# EAGLE design Power Supply (EAGLE 8.4.0)
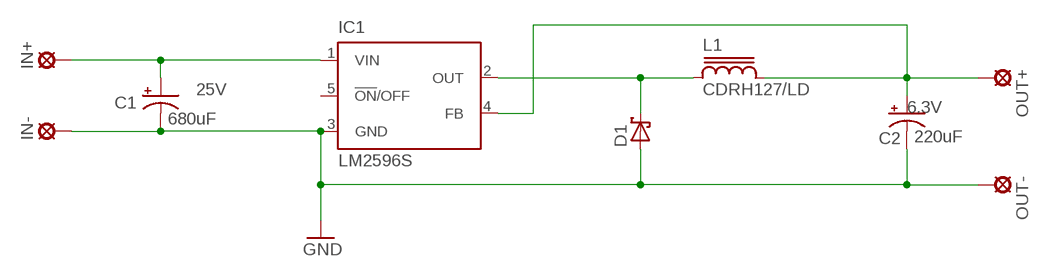
[diagram p0: schematic, sheet 1]

## Parts
C1  680uF  CPOL-USE5-10.5  [E5-10,5]
C2  220uF  CPOL-USUD-6,3X5,8  [UD-6,3X5,8_NICHICON]
D1  SCHOTTKY-DIODESMD  [SMB]
IC1  LM2596S  [TO263-5]
IN+  LSP13  [LSP13]
IN-  LSP13  [LSP13]
L1  CDRH127/LD  [CDRH127/LD]
OUT+  LSP13  [LSP13]
OUT-  LSP13  [LSP13]

## Nets
FB: C2.+ IC1.4(FB) L1.2 OUT+.MP
GND: C1.- C2.- D1.A IC1.3(GND) IN-.MP OUT-.MP
OUT: D1.C IC1.2(OUT) L1.1
VIN: C1.+ IC1.1(VIN) IN+.MP
Unconnected: IC1.5(!ON!/OFF)

## Library data of the parts
C1 = rcl:CPOL-US: POLARIZED CAPACITOR, American symbol; VOLTAGE: 25V
C2 = rcl:CPOL-US: POLARIZED CAPACITOR, American symbol; VOLTAGE: 6.3V
D1 = diode:SCHOTTKY-DIODE: Schottky Diode
IC1 = national-semiconductor:LM2596: SIMPLE SWITCHER® Power Converter 150 kHz 3A Step-Down Voltage Regulator Source: http://www.national.com/ds/LM/LM2596.pdf; MF: NATIONAL SEMICONDUCTOR; MPN: LM2596S-ADJ/NOPB; OC_FARNELL: 9494367; OC_NEWARK: 41K3842
IN+ IN- OUT+ OUT- = solpad:LSP13: SOLDER PAD drill 1.3 mm, distributor Buerklin, 12H562
L1 = inductor-sumida:CDRH127/LD: Power Inductor

## Net classes
0 default: width 1.27 mm

## Board
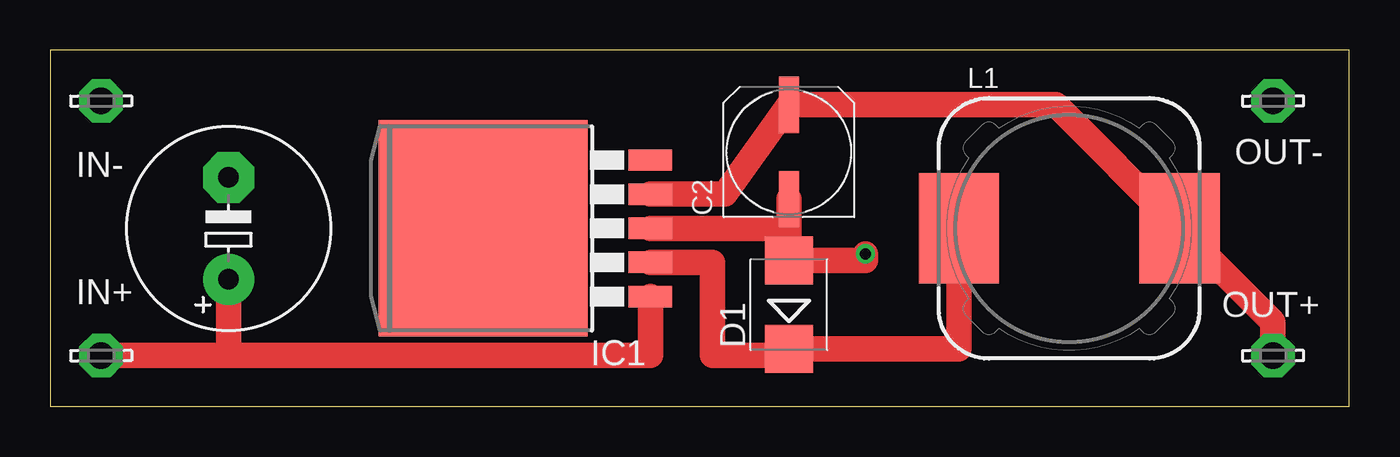
[diagram p1: board, top side]
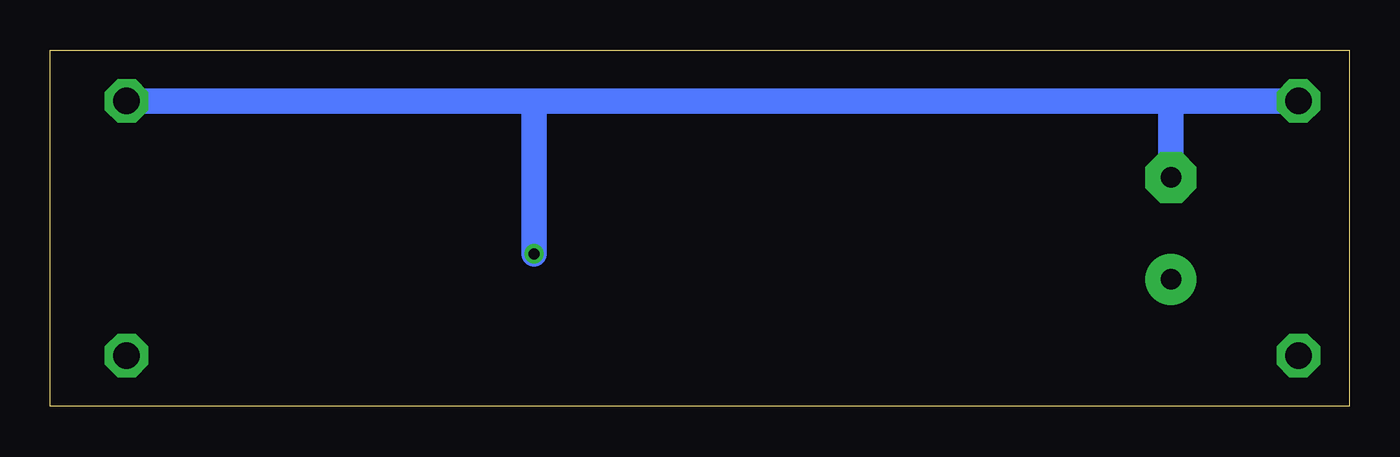
[diagram p2: board, bottom side, seen from below]

Size 64.77 x 17.78 mm. Coordinates in mm from the lower left corner, seen from the top.
Outline: 0,0 64.77,0 64.77,17.78 0,17.78 0,0
Copper layers (1*16): Top 0.035mm / dielectric 1.5mm / Bottom 0.035mm
Design rules "default": minimum track width 10mil, minimum drill 24mil, track to track 8mil, track to pad 8mil, pad to pad 8mil, via to via 8mil, smd to smd 8mil, copper to edge 40mil, drill to drill 8mil, minimum pad ring 10mil, minimum via ring 8mil, stop-mask expansion 4mil, vias tented up to drill 0mil, thermal gap 10mil

### Footprints (pad centres in the part's own frame; a part is rotated, then mirrored left to right if it is on the bottom)
E5-10,5 = drill 1.016 pad 2.54: + -2.54,0 | drill 1.016 pad 2.54 octagon: - 2.54,0
UD-6,3X5,8_NICHICON = smd 2.8 x 1: + 2.35,0; - -2.35,0
SMB = smd 2.4 x 2.4: A 2.2,0; C -2.2,0
TO263-5 = smd 1.067 x 2.159: 1 -3.404,-5.791; 2 -1.702,-5.791; 3 0,-5.791; 4 1.702,-5.791; 5 3.404,-5.791 | smd 10.8 x 10.41: 6 0,2.54
LSP13 = drill 1.321 pad 2.159 octagon: MP 0,0
CDRH127/LD = smd 4 x 5.5: 1 -5.5,0; 2 5.5,0

### Placement (x,y rotation side)
C1  8.89,8.89 90 top
C2  36.83,12.7 90 top
D1  36.83,5.08 90 top
IC1  24.13,8.89 90 top
IN+  2.54,2.54 0 top
IN-  2.54,15.24 0 top
L1  50.8,8.89 0 top
OUT+  60.96,2.54 0 top
OUT-  60.96,15.24 0 top

### Tracks (layer width: path | path; a pad name or v marks a point on that pad's centre or on a via)
FB
  Top 1.27: IC1.4 33.64,10.59 C2.+ 50.14,15.05 L1.2 60.96,4.23 OUT+.MP
GND  (via drill 0.55)
  Top 1.27: C2.- D1.A | IC1.3 36.83,8.89 D1.A | D1.A 40.64,7.28 v40.64,7.62
  Bottom 1.27: 40.64,15.24 OUT-.MP | 40.64,15.24 IN-.MP 8.89,15.24 C1.- | v40.64,7.62 40.64,15.24
OUT
  Top 1.27: IC1.2 33.02,7.19 33.02,2.54 36.83,2.54 D1.C 45.3,2.88 L1.1
VIN
  Top 1.27: IC1.1 29.92,2.54 8.89,2.54 | 8.89,2.54 C1.+ | 8.89,2.54 IN+.MP